# EAGLE schematic stepper_power (EAGLE 7.2.0)
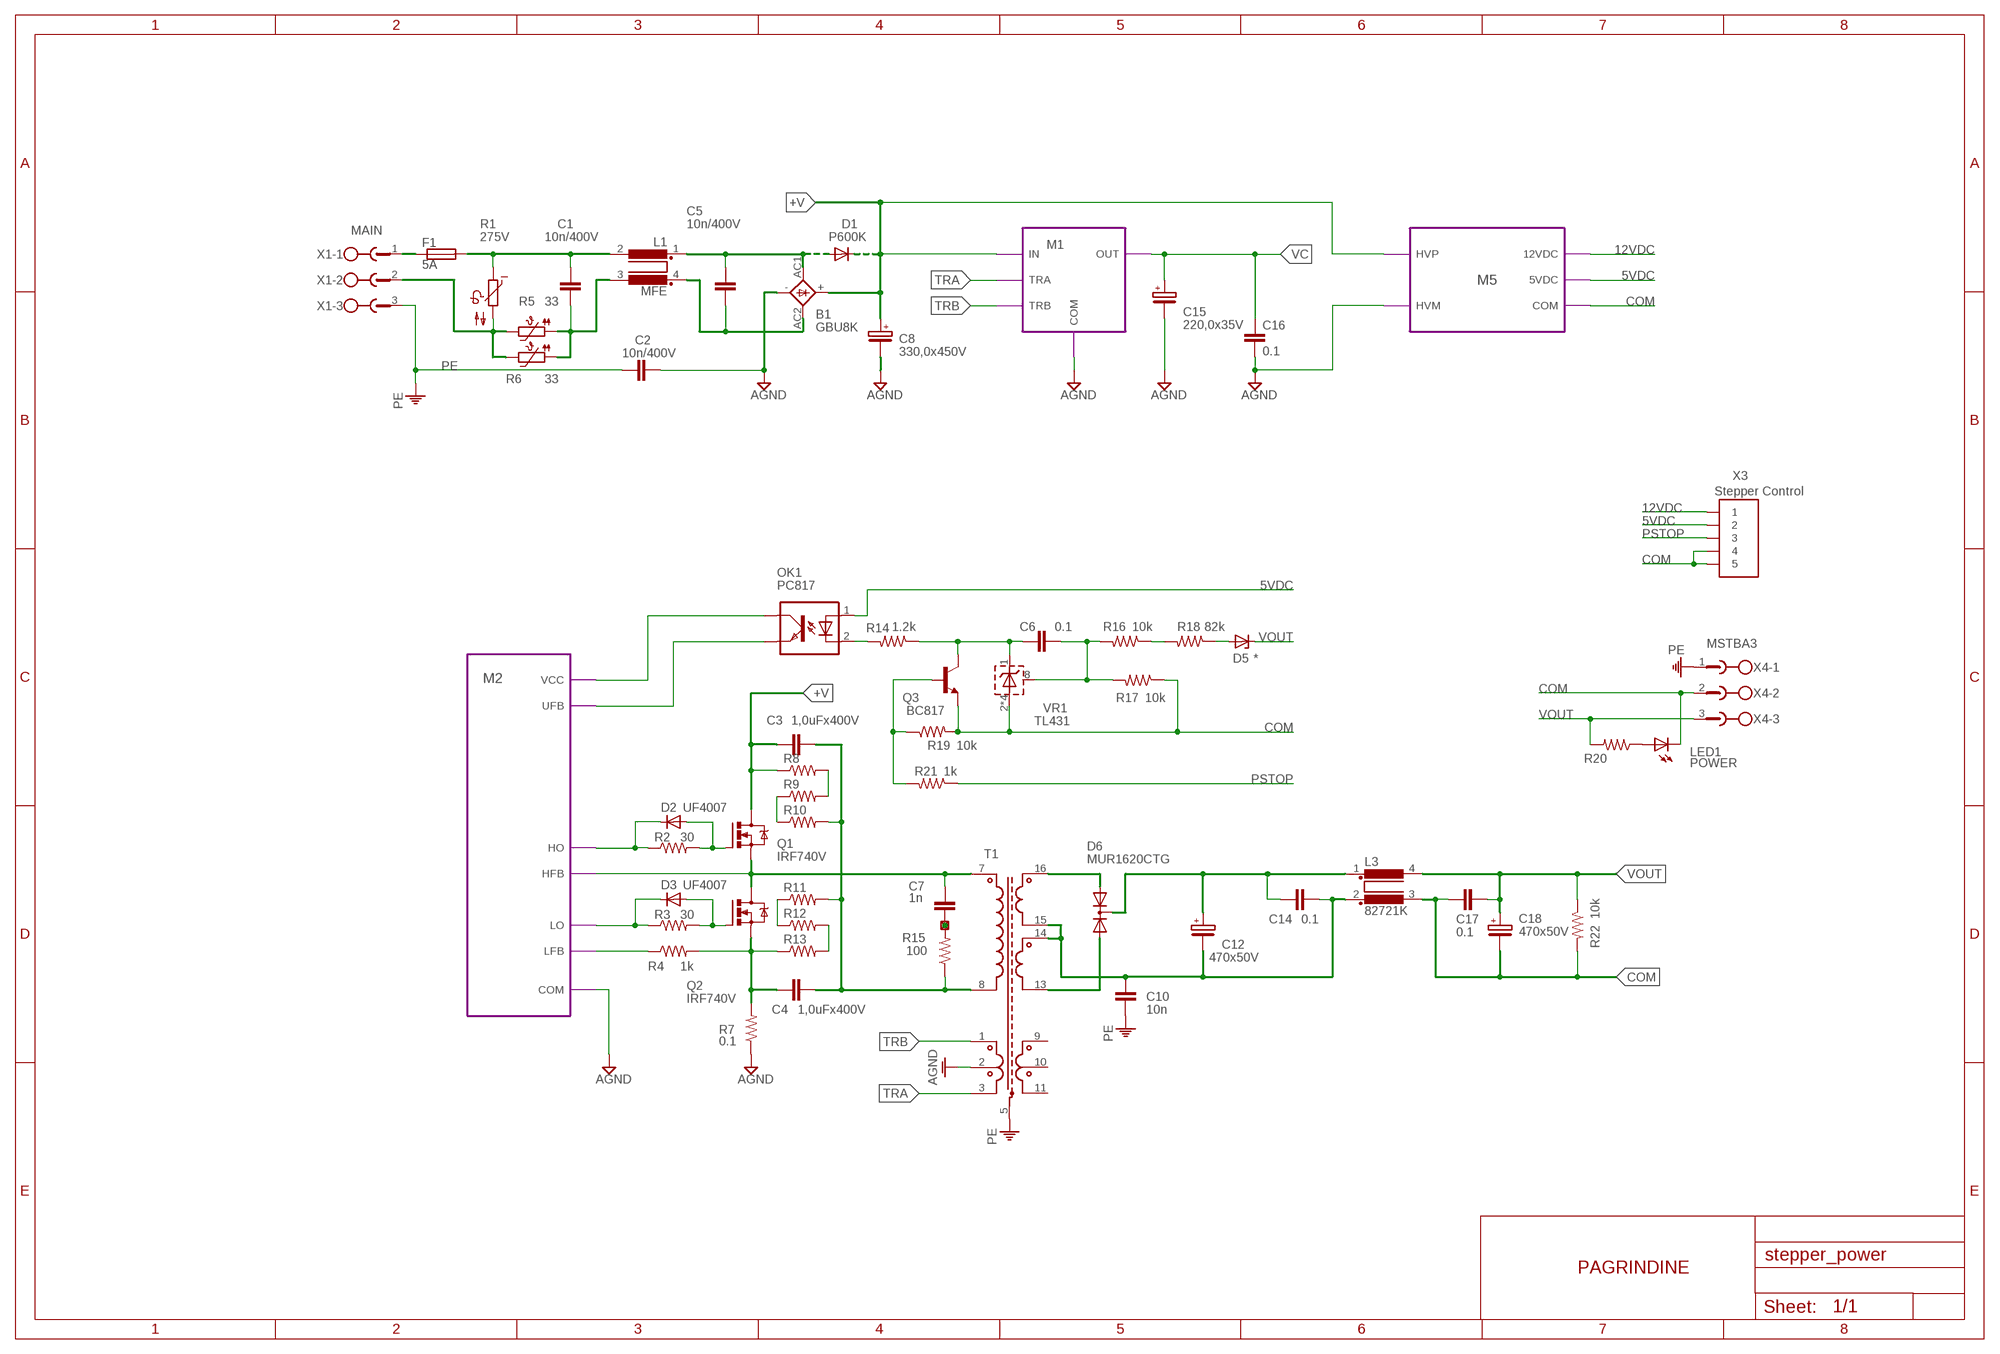
[diagram p0: schematic, sheet 1]

## Parts
B1  GBU8K  GBU4  [GBU4S]
C1  10n/400V  C-EU102-043X133  [C102-043X133]
C2  10n/400V  C-EU075-042X103  [C075-042X103]
C3  1,0uFx400V  C-EU225-108X268  [C225-108X268]
C4  1,0uFx400V  C-EU225-108X268  [C225-108X268]
C5  10n/400V  C-EU102-043X133  [C102-043X133]
C6  0.1  C-EUC0805  [C0805]
C7  1n  C-EU102-043X133  [C102-043X133]
C8  330,0x450V  CPOL-EUE10-25H  [EB25H]
C10  10n  C-EU075-042X103  [C075-042X103]
C12  470x50V  CPOL-EUE3.5-10  [E3,5-10]
C14  0.1  C-EU102-043X133  [C102-043X133]
C15  220,0x35V  CPOL-EUE3.5-8  [E3,5-8]
C16  0.1  C-EUC0805  [C0805]
C17  0.1  C-EU102-043X133  [C102-043X133]
C18  470x50V  CPOL-EUE3.5-10  [E3,5-10]
D1  P600K  DIODE-P6-15-1  [P6-15-1]
D2  UF4007  DIODE-DO214AA  [DO214AA]
D3  UF4007  DIODE-DO214AA  [DO214AA]
D5  *  ZENER-DIODESOD80C  [SOD80C]
D6  MUR1620CTG  DIODE-2AC|CATO220V  [TO220ABS]
F1  5A  SH22,5A  [SH22,5A]
L1  MFE  [MFE]
L3  82721K  [82721K]
LED1  POWER  LEDB155  [Q62902-B155]
OK1  PC817  [DIL04]
P1  SPECIAL_PADSD1.0  [LP_D1.0]
Q1  IRF740V  [TO220BV]
Q2  IRF740V  [TO220BV]
Q3  BC817  BC817-16SMD  [SOT23-BEC]
R1  275V  B57164  [B57164]
R2  30  R-US_R0805  [R0805]
R3  30  R-US_R0805  [R0805]
R4  1k  R-US_R0805  [R0805]
R5  33  PTC-TABL_10  [TABLETE_10]
R6  33  PTC-TABL_10  [TABLETE_10]
R7  0.1  R-US_0411/15  [0411/15]
R8  33k  R-US_R0805  [R0805]
R9  33k  R-US_R0805  [R0805]
R10  33k  R-US_R0805  [R0805]
R11  33k  R-US_R0805  [R0805]
R12  33k  R-US_R0805  [R0805]
R13  33k  R-US_R0805  [R0805]
R14  1.2k  R-US_R0805  [R0805]
R15  100  R-US_0817/22  [P0817/22]
R16  10k  R-US_R0805  [R0805]
R17  10k  R-US_R0805  [R0805]
R18  82k  R-US_R0805  [R0805]
R19  10k  R-US_R0805  [R0805]
R20  R-US_R0805  [R0805]
R21  1k  R-US_R0805  [R0805]
R22  10k  R-US_0204/7  [0204/7]
T1  STEPPER_POWER_SUPPLY_1  [ETD-39-K-H-16P]
VR1  TL431  TL431D  [SO-08]
X1  MAIN  MSTBA3  [MSTBA3]
X3  Stepper Control  5PIN_NS25-W5P  [6410-05]
X4  MSTBA3  [MSTBA3]

## Module instances
M1 = M1
M2 = M2
M5 = M5

## Nets
5VDC: OK1.1(A) X3.2 ; port M5.5VDC
12VDC: X3.1 ; port M5.12VDC
+V [power++]: B1.+ C3.1 C8.+ D1.C Q1.D R8.1 ; port M5.HVP M1.IN
AGND: B1.- C2.2 C8.- C15.- C16.2 R7.1 T1.2(P2C) ; port M1.COM M5.HVM M2.COM
COM [power++]: C17.2 C18.- L3.3 LED1.K(C) Q3.E R17.1 R19.2 R22.2 VR1.2(A) VR1.3(A) VR1.6(A) VR1.7(A) X3.4 X3.5 X4.2 ; port M5.COM
FB: R4.1 ; port M2.LFB
HO [power++]: D2.C R2.1 ; port M2.HO
LO [power]: D3.C R3.1 ; port M2.LO
N$1: OK1.2(C) R14.2
N$2: R11.1 R12.1
N$4 [power++]: C3.2 C4.2 R10.2 R11.2 R15.1 T1.8(P1B)
N$5: C7.2 P1.P$1 R15.2
N$6: D3.A Q2.G R3.2
N$7: D6.1(A1) T1.16(P4A)
N$8: D6.3(A2) T1.13(P5B)
N$9: C6.2 R16.2 R17.2 VR1.8(R)
N$10 [power++]: D5.A R18.1
N$12: C10.2 C12.- C14.1 L3.2 T1.14(P5A) T1.15(P4B)
N$13: Q3.B R19.1 R21.2
N$14 [power++]: C12.+ C14.2 D6.2(C) L3.1
N$16: D2.A Q1.G R2.2
N$19: R12.2 R13.2
N$26: R9.1 R10.1
N$27: R8.2 R9.2
N$28: LED1.A R20.1
N$29 [power++]: C1.2 L1.3 R5.1 R6.1
N$30 [power++]: C1.1 F1.2 L1.2 R1.1
N$31 [power++]: R1.2 R5.2 R6.2 X1.2
N$32 [power++]: F1.1 X1.1
N$33: C6.1 Q3.C R14.1 VR1.1(C)
N$34: B1.AC2(AC1) C5.2 L1.4
N$36: R16.1 R18.2
N$37 [power]: C4.1 Q2.S R4.2 R7.2 R13.1
N$43 [power++]: B1.AC1(AC2) C5.1 D1.A L1.1
OKE [power]: OK1.3(EMIT) ; port M2.UFB
PE [power++]: C2.1 C10.1 T1.5(PE) X1.3 X4.1
PSTOP: R21.1 X3.3
TRA [power]: T1.3(P2B) ; port M1.TRA
TRB [power]: T1.1(P2A) ; port M1.TRB
VB [power++]: C7.1 Q1.S Q2.D T1.7(P1A) ; port M2.HFB
VC [power]: C15.+ C16.1 OK1.4(COL) ; port M2.VCC M1.OUT
VOUT [power++]: C17.1 C18.+ D5.C L3.4 R20.2 R22.1 X4.3
Unconnected: T1.9(P3A) T1.10(P3C) T1.11(P3B)

## Notes on the sheet
- PAGRINDINE

## Library data of the parts
B1 = rectifier:GBU4: GENERAL INSTRUMENT RECTIFIER
C1-C7 C10 C14 C16 C17 = rcl:C-EU: CAPACITOR, European symbol
C8 C12 C15 C18 = rcl:CPOL-EU: POLARIZED CAPACITOR, European symbol
D1-D3 = diode:DIODE-: DIODE
D5 = diode:ZENER-DIODE: Z-Diode
D6 = diode:DIODE-2AC|CA: Dual DIODE Anode-Cathode|Cathode-Anode
F1 = fuse:SH22,5A: FUSE HOLDER grid 22,5mm, isolated cap OGN0031 8201, Schurter (Buerklin)
L1 = inductors:MFE: FILTER
L3 = inductors:82721K: FILTER
LED1 = led:LED: LED OSRAM: - CHIPLED LG R971, LG N971, LY N971, LG Q971, LY Q971, LO R971, LY R971 LH N974, LH R974 LS Q976, LO Q976, LY Q976 LO Q996 - Hyper CHIPLED LW Q18S LB Q993, LB Q99A, LB R99A - SideLED LS A670, LO A670, LY A670, LG A670, LP A670 LB A673, LV A673, LT A673, LW A673 LH A674 LY A675 LS A676, LA A676, LO A676, LY A676, LW A676 LS A679, LY A679, LG A679 - Hyper Micro SIDELED® LS Y876, LA Y876, LO Y876, LY Y876 LT Y87S - SmartLED LW L88C, LW L88S LB L89C, LB L89S, LG L890 LS L89K, LO L89K, LY L89K LS L896, LA L896, LO L896, LY L896 - TOPLED LS T670, LO T670, LY T670, LG T670, LP T670 LSG T670, LSP T670, LSY T670, LOP T670, LYG T670 LG T671, LOG T671, LSG T671 LB T673, LV T673, LT T673, LW T673 LH T674 LS T676, LA T676, LO T676, LY T676, LB T676, LH T676, LSB T676, LW T676 LB T67C, LV T67C, LT T67C, LS T67K, LO T67K, LY T67K, LW E67C LS E67B, LA E67B, LO E67B, LY E67B, LB E67C, LV E67C, LT E67C LW T67C LS T679, LY T679, LG T679 LS T770, LO T770, LY T770, LG T770, LP T770 LB T773, LV T773, LT T773, LW T773 LH T774 LS E675, LA E675, LY E675, LS T675 LS T776, LA T776, LO T776, LY T776, LB T776 LHGB T686 LT T68C, LB T68C - Hyper Mini TOPLED® LB M676 - Mini TOPLED Santana® LG M470 LS M47K, LO M47K, LY M47K Source: http://www.osram.convergy.de LUXEON: - LUMILED® LXK2-PW12-R00, LXK2-PW12-S00, LXK2-PW14-U00, LXK2-PW14-V00 LXK2-PM12-R00, LXK2-PM12-S00, LXK2-PM14-U00 LXK2-PE12-Q00, LXK2-PE12-R00, LXK2-PE12-S00, LXK2-PE14-T00, LXK2-PE14-U00 LXK2-PB12-K00, LXK2-PB12-L00, LXK2-PB12-M00, LXK2-PB14-N00, LXK2-PB14-P00, LXK2-PB14-Q00 LXK2-PR12-L00, LXK2-PR12-M00, LXK2-PR14-Q00, LXK2-PR14-R00 LXK2-PD12-Q00, LXK2-PD12-R00, LXK2-PD12-S00 LXK2-PH12-R00, LXK2-PH12-S00 LXK2-PL12-P00, LXK2-PL12-Q00, LXK2-PL12-R00 Source: www.luxeon.com KINGBRIGHT: KA-3528ASYC Source: www.kingbright.com
OK1 = optocoupler:PC817: SHARP OPTO COUPLER
P1 = misc:SPECIAL_PADS
Q1 Q2 = transistor-power:IRF740: N-CHANNEL MOS FET
Q3 = transistor-npn:BC817*: NPN Transistor
R1 = ptc-ntc:B57164: SIEMENS NTC
R2-R4 R7-R22 = rcl:R-US_: RESISTOR, American symbol
R5 R6 = ptc-ntc:PTC-: Positive Temperature Coefficient Resistor (PTC) termistor Philips KTY81-210 - KTY81-252 Source: 153627-da-01-en-Temperatur-Sensor_KTY10-6_Philips.pdf
T1 = trafo:STEPPER_POWER_SUPPLY_1
VR1 = v-reg:TL431*: VOLTAGE REGULATOR
X1 X4 = con-phoenix-508:MSTBA3: PHOENIX
X3 = connectors:5PIN_

## Module M1
Ports: IN(pwr) COM(pas) OUT(out) TRA(pwr) TRB(pwr)
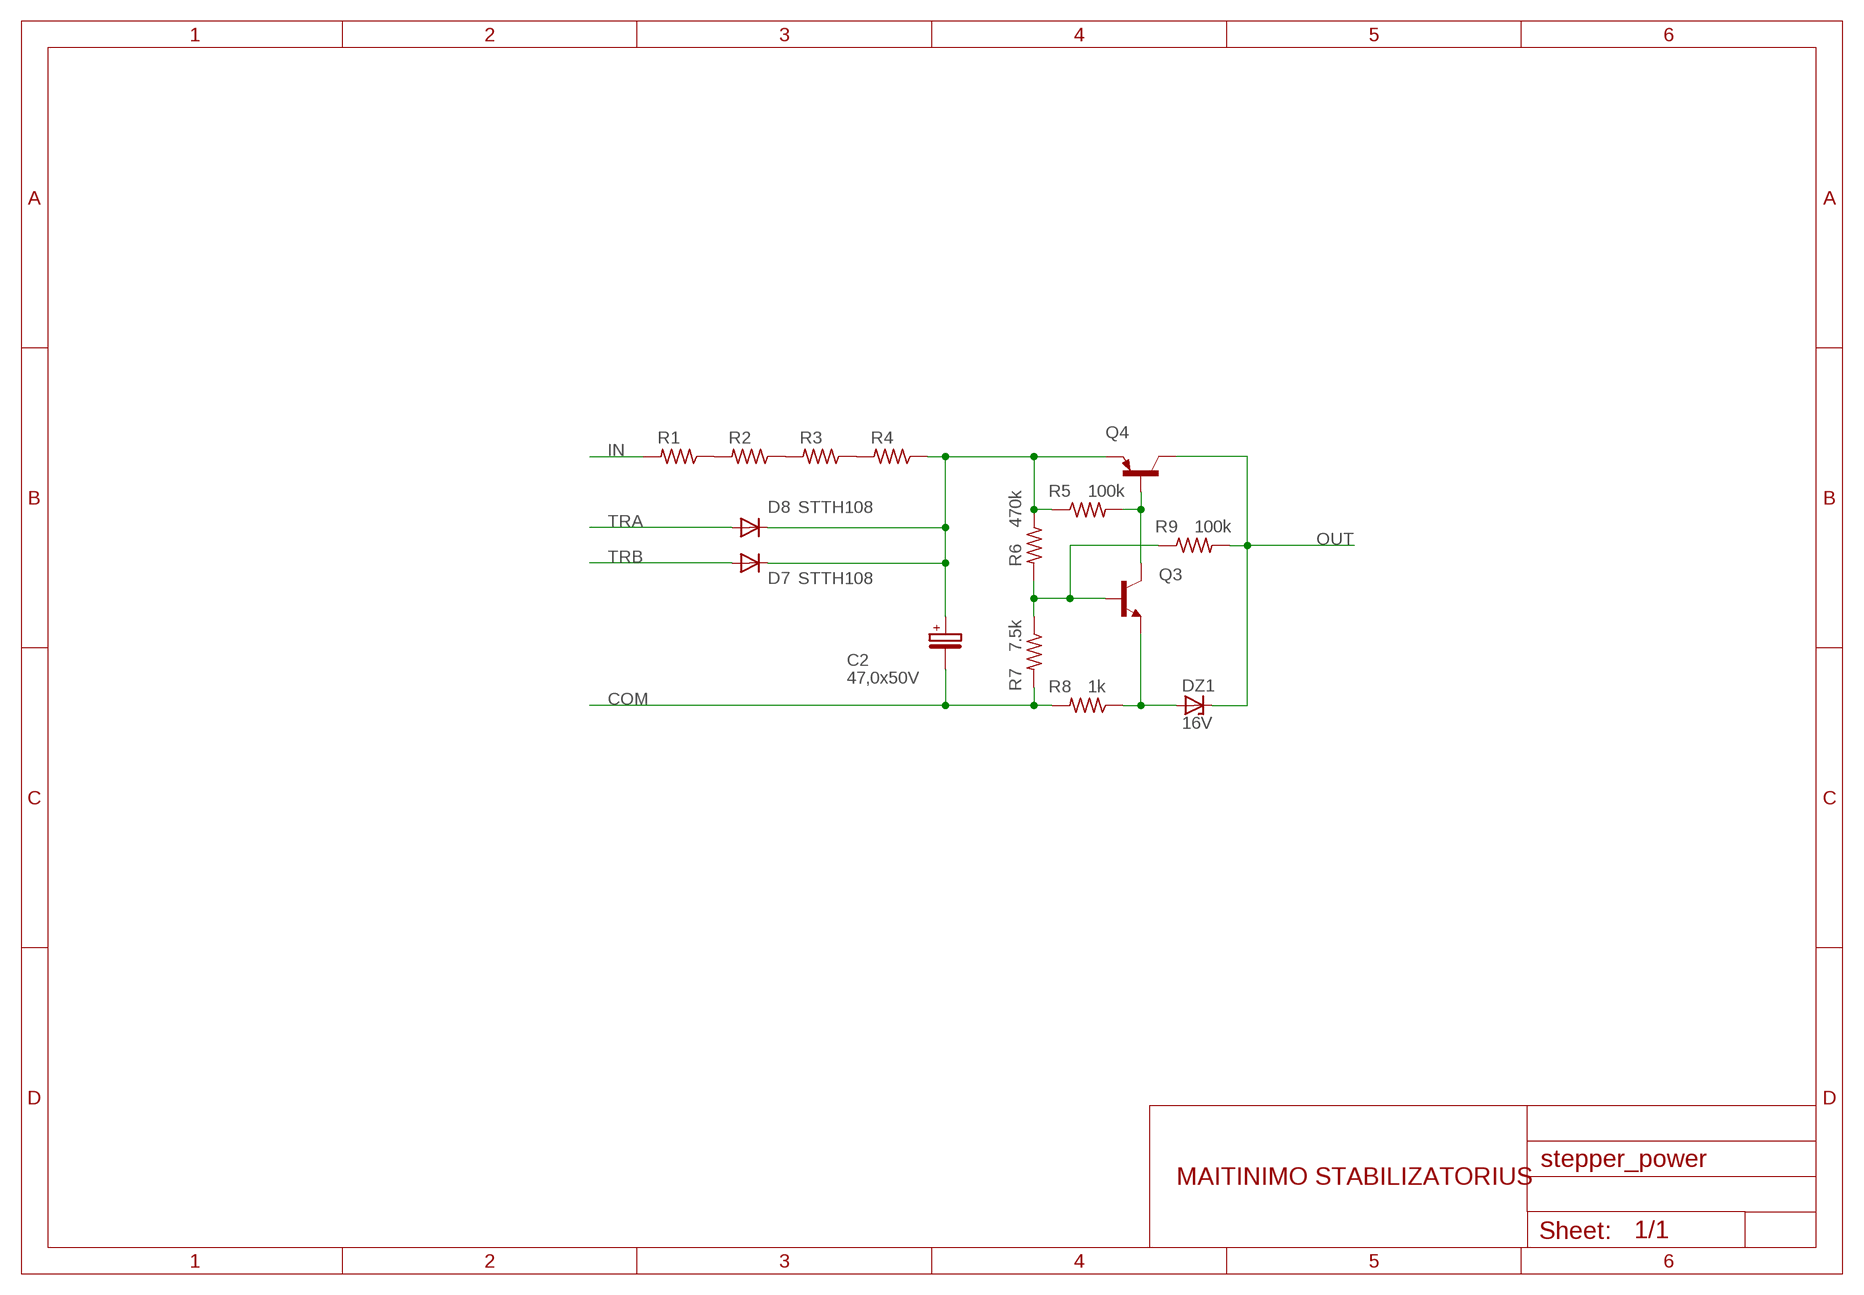
[diagram p1: schematic, module M1, sheet 1]

### Parts
C2  47,0x50V  CPOL-EUE2.5-7  [E2,5-7]
D7  STTH108  DIODE-DO214AA  [DO214AA]
D8  STTH108  DIODE-DO214AA  [DO214AA]
DZ1  16V  ZENER-DIODESOD80C  [SOD80C]
Q3  BC817-16SMD  [SOT23-BEC]
Q4  BC807-16SMD  [SOT23-BEC]
R1  47k  R-US_R0805  [R0805]
R2  47k  R-US_R0805  [R0805]
R3  47k  R-US_R0805  [R0805]
R4  47k  R-US_R0805  [R0805]
R5  100k  R-US_R0805  [R0805]
R6  470k  R-US_R0805  [R0805]
R7  7.5k  R-US_R0805  [R0805]
R8  1k  R-US_R0805  [R0805]
R9  100k  R-US_R0805  [R0805]

### Nets
COM: C2.- R7.2 R8.2
IN: R1.2
N$1 [power]: C2.+ D7.C D8.C Q4.E R4.1 R5.1 R6.1
N$2: Q3.B R6.2 R7.1 R9.1
N$3: DZ1.A Q3.E R8.1
N$4: Q3.C Q4.B R5.2
N$5: R3.1 R4.2
N$8: R1.1 R2.2
N$9: R2.1 R3.2
OUT [power]: DZ1.C Q4.C R9.2
TRA: D8.A
TRB: D7.A

### Notes on the sheet
- MAITINIMO STABILIZATORIUS

### Library data of the parts
C2 = rcl:CPOL-EU: POLARIZED CAPACITOR, European symbol
D7 D8 = diode:DIODE-: DIODE
DZ1 = diode:ZENER-DIODE: Z-Diode
Q3 = transistor-npn:BC817*: NPN Transistor
Q4 = transistor-pnp:BC807*: PNP Transistror
R1-R9 = rcl:R-US_: RESISTOR, American symbol

## Module M2
Ports: UFB(in) HFB(in) HO(out) LO(out) LFB(in) COM(pas) VCC(pwr)
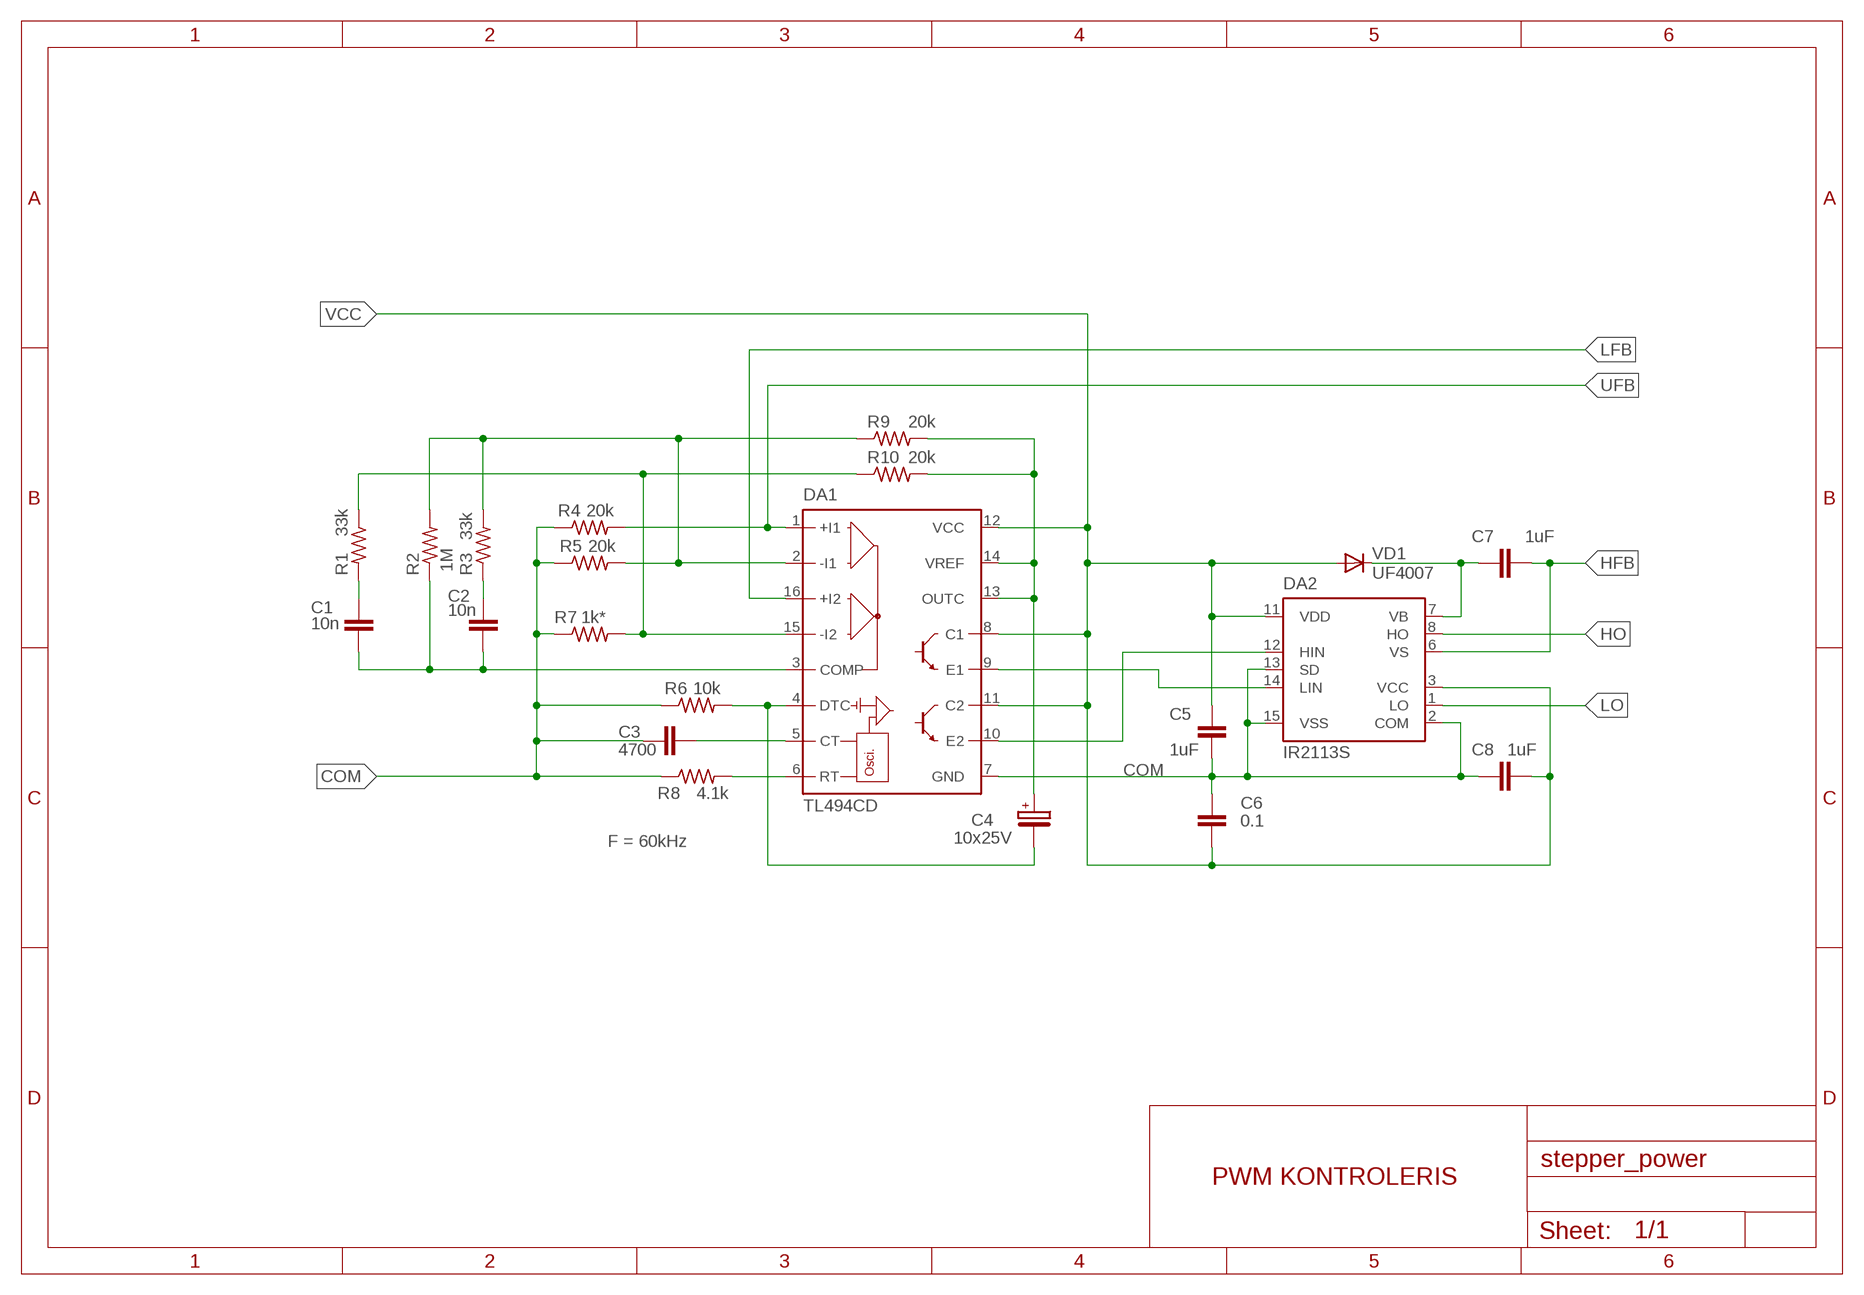
[diagram p2: schematic, module M2, sheet 1]

### Parts
C1  10n  C-EUC0805  [C0805]
C2  10n  C-EUC0805  [C0805]
C3  4700  C-EUC0805  [C0805]
C4  10x25V  CPOL-EUE2-5  [E2-5]
C5  1uF  C-EUC1206  [C1206]
C6  0.1  C-EUC0805  [C0805]
C7  1uF  C-EUC1206  [C1206]
C8  1uF  C-EUC1206  [C1206]
DA1  TL494CD  [SO16]
DA2  IR2113S  [SO16L]
R1  33k  R-US_R0805  [R0805]
R2  1M  R-US_R0805  [R0805]
R3  33k  R-US_R0805  [R0805]
R4  20k  R-US_R0805  [R0805]
R5  20k  R-US_R0805  [R0805]
R6  10k  R-US_R0805  [R0805]
R7  1k*  R-US_R0805  [R0805]
R8  4.1k  R-US_R0805  [R0805]
R9  20k  R-US_R0805  [R0805]
R10  20k  R-US_R0805  [R0805]
VD1  UF4007  DIODE-DO41-10  [DO41-10]

### Nets
COM: C3.2 C5.2 C6.1 C8.2 DA1.7(GND) DA2.2(COM) DA2.13(SD) DA2.15(VSS) R4.1 R5.1 R6.1 R7.1 R8.1
HFB [power++]: C7.2 DA2.6(VS)
HO [power++]: DA2.8(HO)
LFB: DA1.16(+I2)
LO [power]: DA2.1(LO)
N$1: DA1.9(E1) DA2.14(LIN)
N$2: DA1.10(E2) DA2.12(HIN)
N$3 [power++]: C7.1 DA2.7(VB) VD1.C
N$4: DA1.6(RT) R8.2
N$5: C3.1 DA1.5(CT)
N$6: C1.1 R1.2
N$7: C1.2 C2.1 DA1.3(COMP) R2.1
N$8: DA1.2(-I1) R2.2 R3.2 R5.2 R9.1
N$9: C4.+ DA1.13(OUTC) DA1.14(VREF) R9.2 R10.2
N$10: C2.2 R3.1
N$11: DA1.15(-I2) R1.1 R7.2 R10.1
N$12: C4.- DA1.4(DTC) R6.2
UFB [power]: DA1.1(+I1) R4.2
VCC [power]: C5.1 C6.2 C8.1 DA1.8(C1) DA1.11(C2) DA1.12(VCC) DA2.3(VCC) DA2.11(VDD) VD1.A

### Notes on the sheet
- F = 60kHz
- PWM KONTROLERIS

### Library data of the parts
C1-C3 C5-C8 = rcl:C-EU: CAPACITOR, European symbol
C4 = rcl:CPOL-EU: POLARIZED CAPACITOR, European symbol
DA1 = linear:TL494*: SWITCHMODE Pulse Width Modulation Control Circuit NCV494B http://onsemi.com tl494-d.pdf
DA2 = ir:IR211*
R1-R10 = rcl:R-US_: RESISTOR, American symbol
VD1 = diode:DIODE-: DIODE

## Module M5
Ports: HVP(pwr) HVM(pwr) 12VDC(pwr) 5VDC(pwr) COM(pwr)
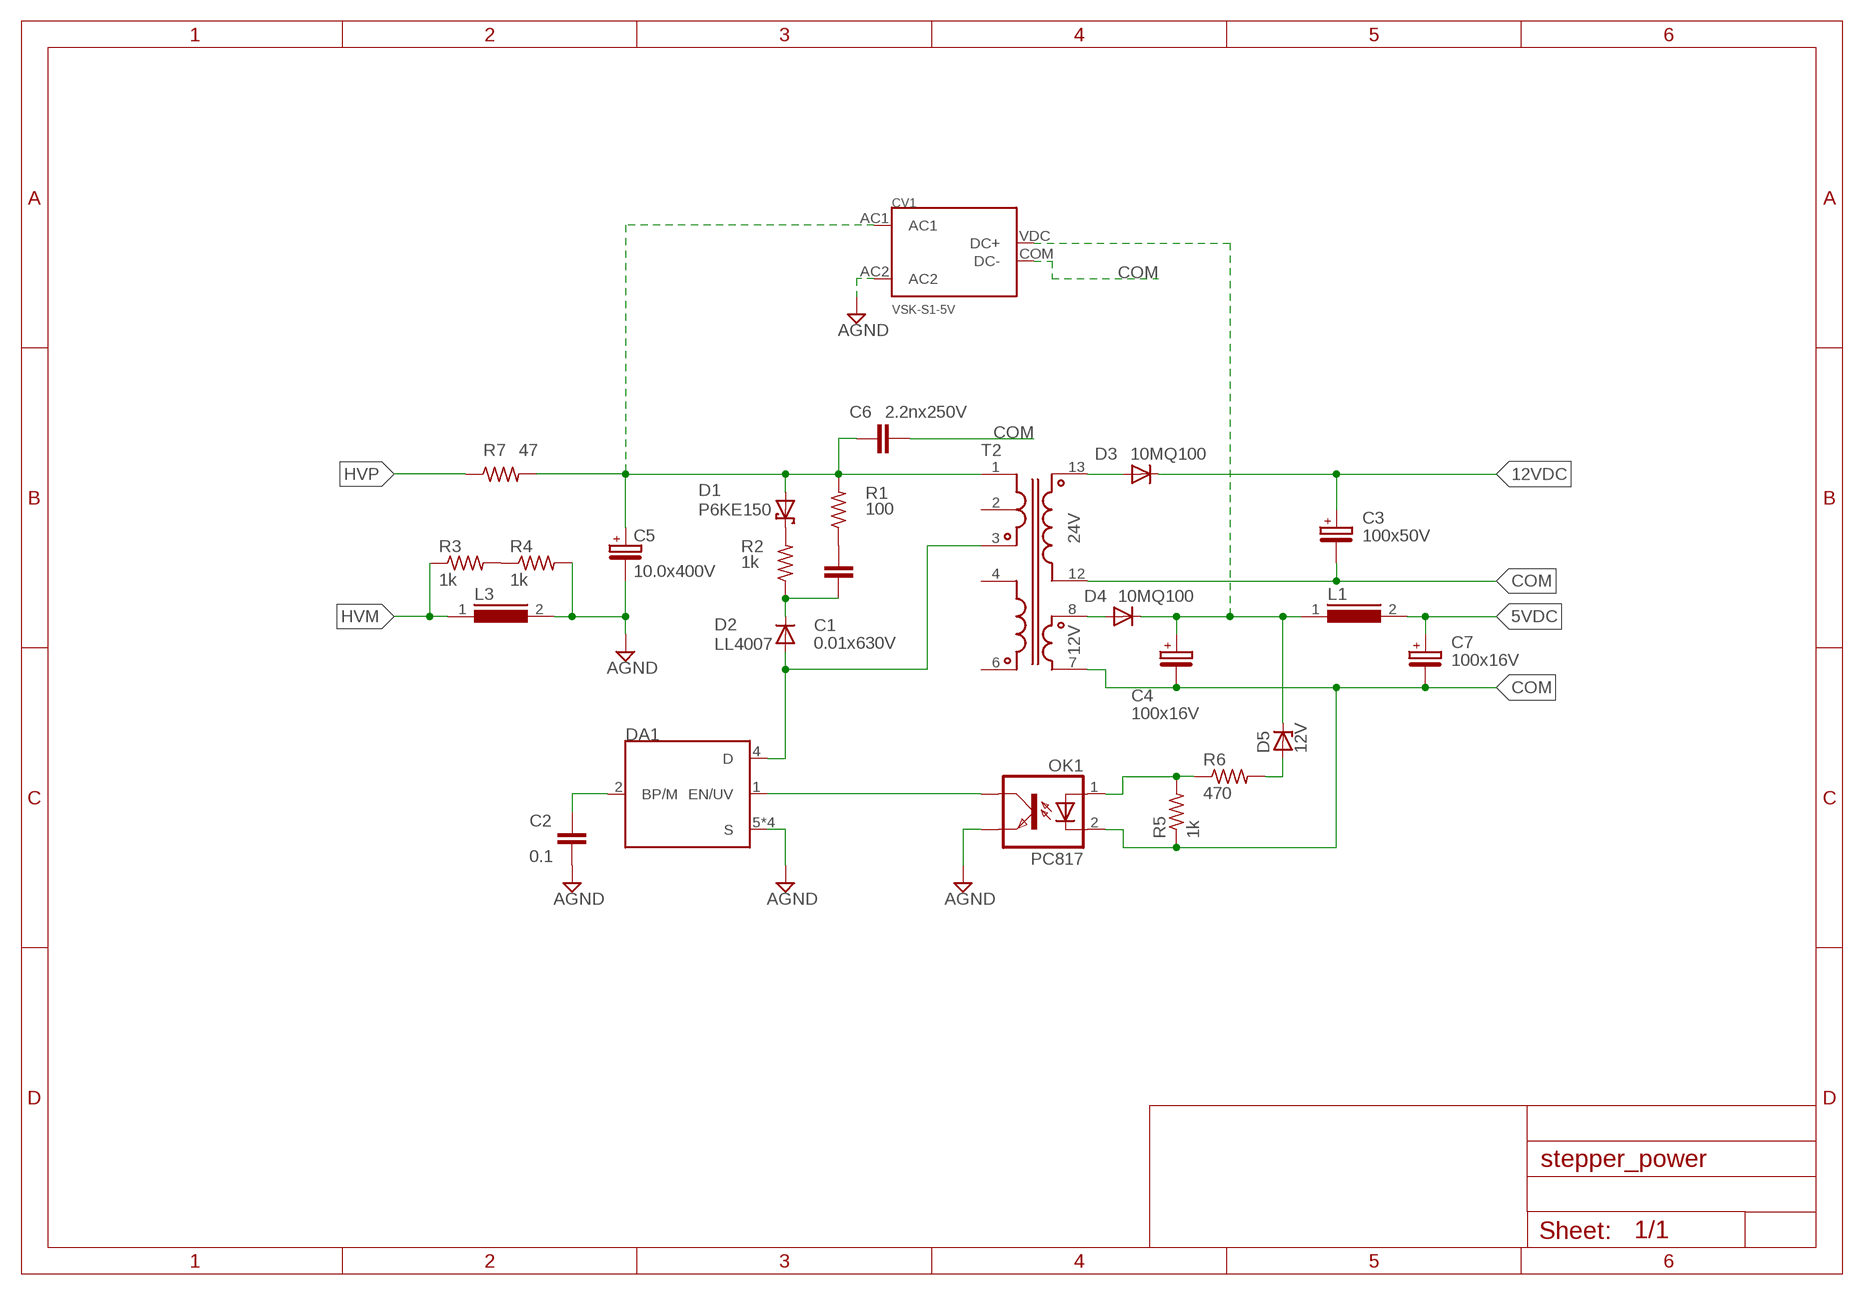
[diagram p3: schematic, module M5, sheet 1]

### Parts
C1  0.01x630V  C-EU102-043X133  [C102-043X133]
C2  0.1  C-EUC0805  [C0805]
C3  100x50V  CPOL-EUE3.5-8  [E3,5-8]
C4  100x16V  CPOL-EUE3.5-8  [E3,5-8]
C5  10.0x400V  CPOL-EUE5-10.5  [E5-10,5]
C6  2.2nx250V  C-EU102-043X133  [C102-043X133]
C7  100x16V  CPOL-EUE3.5-8  [E3,5-8]
CV1  VSK-S1-5V  VSK-S1  [VSK-S1]
D1  P6KE150  P6KEXX  [CB417-15]
D2  LL4007  DIODE-MELF-MLL41  [MELF-MLL41]
D3  10MQ100  DIODE-DO214AC  [DO214AC]
D4  10MQ100  DIODE-DO214AC  [DO214AC]
D5  12V  ZENER-DIODESOD80C  [SOD80C]
DA1  TNY278  [DIP8_1]
L1  INDUCTOR  [PLOKSCIAS]
L3  INDUCTOR  [PLOKSCIAS]
OK1  PC817  [DIL04]
R1  100  R-US_0207/7  [0207/7]
R2  1k  R-US_0207/7  [0207/7]
R3  1k  R-US_R1206  [R1206]
R4  1k  R-US_R1206  [R1206]
R5  1k  R-US_R0805  [R0805]
R6  470  R-US_R0805  [R0805]
R7  47  R-US_0309/12  [0309/12]
T2  750841630  [750841630]

### Nets
5VDC: C7.+ L1.2
12VDC: C3.+ D3.C
AGND: C2.2 C5.- CV1.AC2 DA1.5(S) DA1.6(S) DA1.7(S) DA1.8(S) L3.2 OK1.3(EMIT) R4.2
COM: C3.- C4.- C6.2 C7.- CV1.COM(DC-) OK1.2(C) R5.1 T2.7 T2.12
HVM: L3.1 R3.1
HVP: R7.1
N$1: C1.2 R1.1
N$2: D1.C R2.2
N$3: C5.+ C6.1 CV1.AC1 D1.A R1.2 R7.2 T2.1
N$4: C1.1 D2.C R2.1
N$5: C2.1 DA1.2(BP/M)
N$6: D2.A DA1.4(D) T2.3
N$7: C4.+ CV1.VDC(DC+) D4.C D5.C L1.1
N$8: DA1.1(EN/UV) OK1.4(COL)
N$9: D3.A T2.13
N$10: D4.A T2.8
N$13: OK1.1(A) R5.2 R6.1
N$15: R3.2 R4.1
N$16: D5.A R6.2
Unconnected: T2.2 T2.4 T2.6

### Notes on the sheet
- 24V
- 12V

### Library data of the parts
C1 C2 C6 = rcl:C-EU: CAPACITOR, European symbol
C3-C5 C7 = rcl:CPOL-EU: POLARIZED CAPACITOR, European symbol
CV1 = descreet:VSK-S1
D1 = diode:P6KEXX: DIODE transient-voltage suppressor
D2-D4 = diode:DIODE-: DIODE
D5 = diode:ZENER-DIODE: Z-Diode
DA1 = linear:TNY278
L1 L3 = inductors:INDUCTOR
OK1 = optocoupler:PC817: SHARP OPTO COUPLER
R1-R7 = rcl:R-US_: RESISTOR, American symbol
T2 = trafo:750841630

## Net classes
0 default: clearance 0.205 mm
1 power: clearance 0.305 mm to class 0, clearance 0.305 mm
2 power++: clearance 0.5 mm